# Altium schematic sheet 0_COVER.SchDoc: SmartHalo - Cover
size B; Author: Sébastien Gélinas; Organization: SmartHalo; Address1: 5445 de Gaspé; Address2: Montréal, QC; Address3: Canada; Address4: H2T 3B2; DocumentNumber: 1; Revision: 1; SheetNumber: 0; SheetTotal: 8
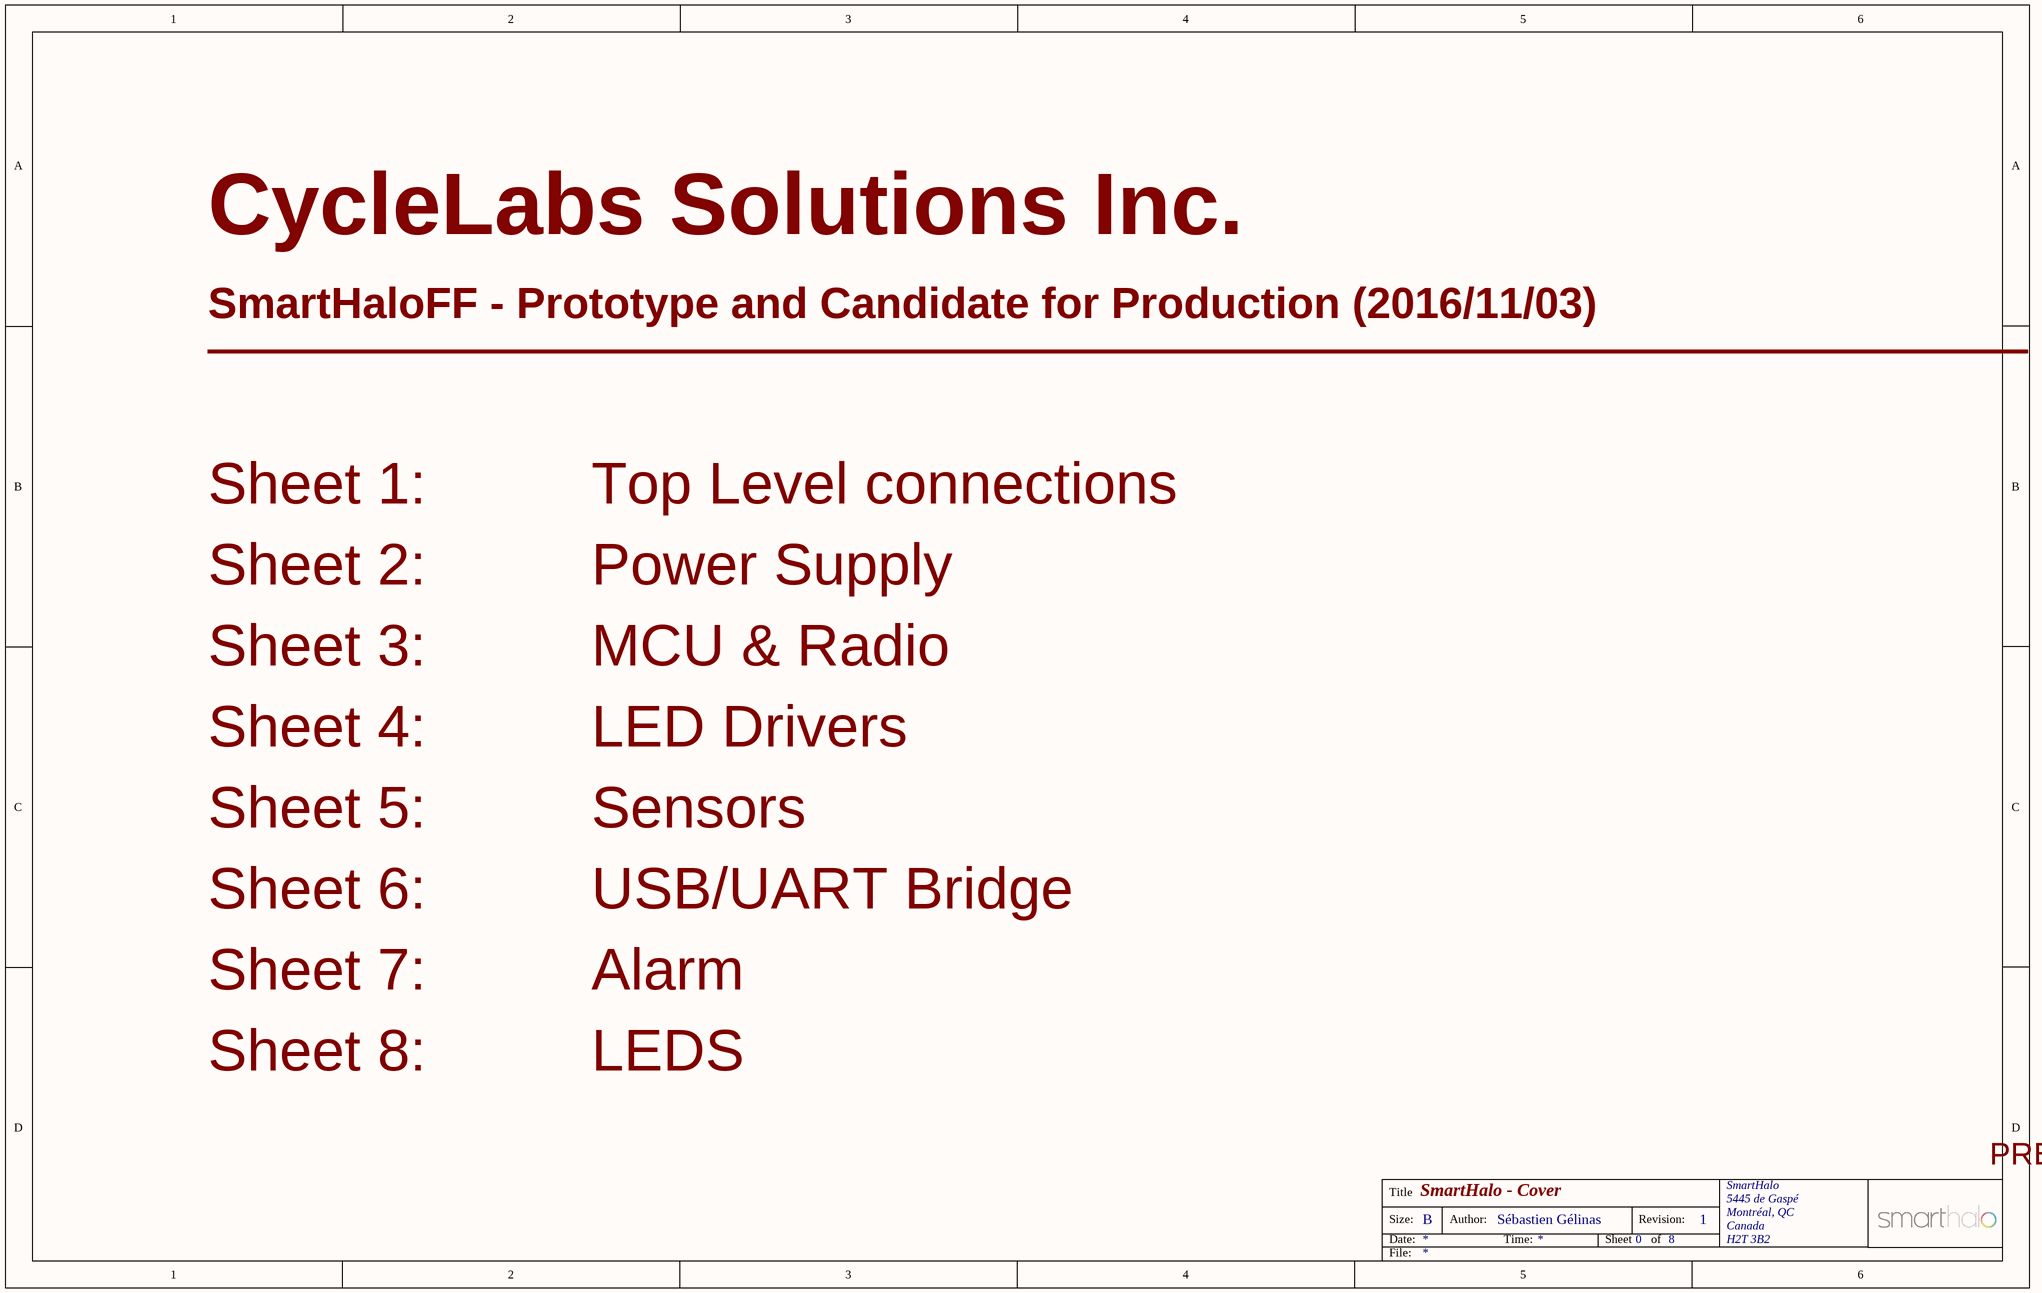
[diagram p0: 0_COVER.SchDoc]

## Notes on the sheet
- CycleLabs Solutions Inc.
- SmartHaloFF - Prototype and Candidate for Production (2016/11/03)
- ________________________________________________________
- Sheet 1:          Top Level connections
- Sheet 2:          Power Supply
- Sheet 3:          MCU & Radio
- Sheet 4:          LED Drivers
- Sheet 5:          Sensors
- Sheet 6:          USB/UART Bridge
- Sheet 7:          Alarm
- Sheet 8:          LEDS
- PRELIMINARY: DO NOT USE FOR PRODUCTION
- Title
- Size:
- Date:
- B
- Author:
- Time:
- Sheet
- Revision:
- of
- File: